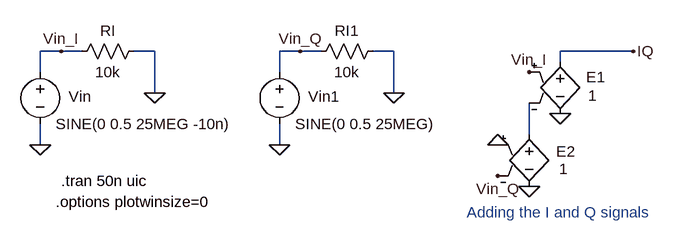
[diagram p0: schematic _Fig8_1_MSD.asc]
_Fig8_1_MSD.asc, the LTspice schematic file:
Version 4
SHEET 1 880 680
WIRE -608 160 -640 160
WIRE -576 160 -608 160
WIRE -464 160 -496 160
WIRE -240 160 -272 160
WIRE -208 160 -240 160
WIRE -96 160 -128 160
WIRE 272 160 160 160
WIRE 160 176 160 160
WIRE -640 192 -640 160
WIRE -272 192 -272 160
WIRE -464 224 -464 160
WIRE -96 224 -96 160
WIRE 112 288 112 240
WIRE -640 304 -640 272
WIRE -272 304 -272 272
FLAG -640 304 0
FLAG -608 160 Vin_I
FLAG -464 224 0
FLAG -272 304 0
FLAG -240 160 Vin_Q
FLAG -96 224 0
FLAG 112 192 Vin_I
FLAG 64 352 Vin_Q
FLAG 64 304 0
FLAG 112 368 0
FLAG 160 256 0
FLAG 272 160 IQ
SYMBOL res -480 144 R90
WINDOW 0 0 56 VBottom 0
WINDOW 3 32 56 VTop 0
SYMATTR InstName RI
SYMATTR Value 10k
SYMBOL voltage -640 176 R0
WINDOW 0 44 54 Left 0
WINDOW 123 0 0 Left 0
WINDOW 39 0 0 Left 0
SYMATTR InstName Vin
SYMATTR Value SINE(0 0.5 25MEG -10n)
SYMBOL res -112 144 R90
WINDOW 0 0 56 VBottom 0
WINDOW 3 32 56 VTop 0
SYMATTR InstName RI1
SYMATTR Value 10k
SYMBOL voltage -272 176 R0
WINDOW 0 44 54 Left 0
WINDOW 123 0 0 Left 0
WINDOW 39 0 0 Left 0
SYMATTR InstName Vin1
SYMATTR Value SINE(0 0.5 25MEG)
SYMBOL e 160 160 R0
WINDOW 0 40 40 Left 0
WINDOW 3 43 68 Left 0
SYMATTR InstName E1
SYMATTR Value 1
SYMBOL e 112 272 R0
WINDOW 0 42 42 Left 0
WINDOW 3 46 69 Left 0
SYMATTR InstName E2
SYMATTR Value 1
TEXT -608 360 Left 0 !.tran 50n uic
TEXT -616 392 Left 0 !.options plotwinsize=0
TEXT 16 408 Left 0 ;Adding the I and Q signals

The netlist it stands for:
* _Fig8_1_MSD.asc
RI 0 Vin_I 10k
Vin Vin_I 0 SINE(0 0.5 25MEG -10n)
RI1 0 Vin_Q 10k
Vin1 Vin_Q 0 SINE(0 0.5 25MEG)
E1 IQ 0 Vin_I N001 1
E2 N001 0 0 Vin_Q 1
.tran 50n uic
.options plotwinsize=0
* Adding the I and Q signals
.backanno
.end